# EAGLE design OR gate (EAGLE 6.5.0)
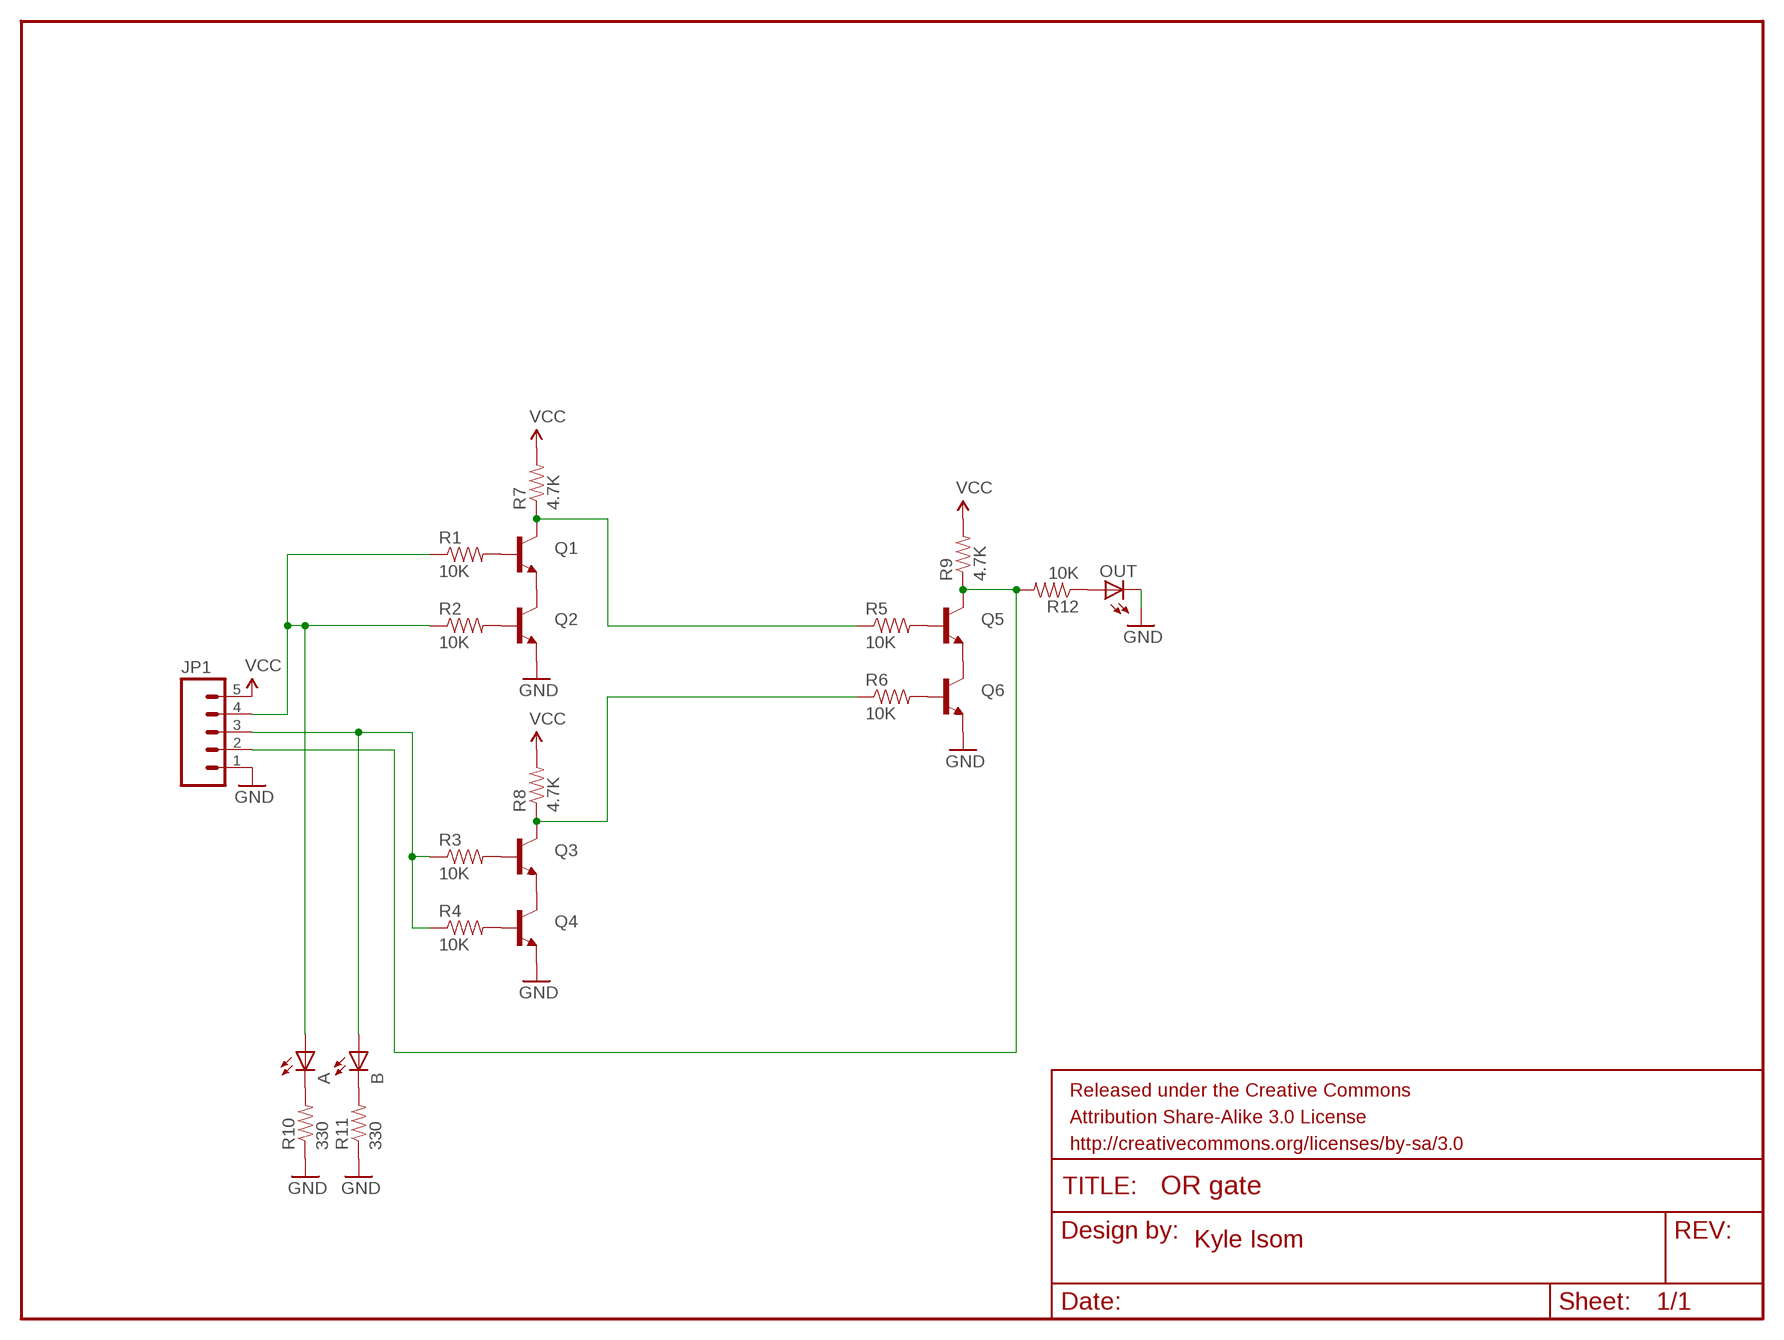
[diagram p0: schematic, sheet 1]

## Parts
A  LED3MM  [LED3MM]
B  LED3MM  [LED3MM]
FRAME1  FRAME-LETTER  [CREATIVE_COMMONS]
JP1  M05LOCK  [1X05_LOCK]
OUT  LED3MM  [LED3MM]
Q1  TRANSISTOR_NPNTO-92-AMMO  [TO-92-AMMO]
Q2  TRANSISTOR_NPNTO-92-AMMO  [TO-92-AMMO]
Q3  TRANSISTOR_NPNTO-92-AMMO  [TO-92-AMMO]
Q4  TRANSISTOR_NPNTO-92-AMMO  [TO-92-AMMO]
Q5  TRANSISTOR_NPNTO-92-AMMO  [TO-92-AMMO]
Q6  TRANSISTOR_NPNTO-92-AMMO  [TO-92-AMMO]
R1  10K  RESISTORPTH-1/4W  [AXIAL-0.4]
R2  10K  RESISTORPTH-1/4W  [AXIAL-0.4]
R3  10K  RESISTORPTH-1/4W  [AXIAL-0.4]
R4  10K  RESISTORPTH-1/4W  [AXIAL-0.4]
R5  10K  RESISTORPTH-1/4W  [AXIAL-0.4]
R6  10K  RESISTORPTH-1/4W  [AXIAL-0.4]
R7  4.7K  RESISTORPTH-1/4W  [AXIAL-0.4]
R8  4.7K  RESISTORPTH-1/4W  [AXIAL-0.4]
R9  4.7K  RESISTORPTH-1/4W  [AXIAL-0.4]
R10  330  RESISTORPTH-1/4W  [AXIAL-0.4]
R11  330  RESISTORPTH-1/4W  [AXIAL-0.4]
R12  10K  RESISTORPTH-1/4W  [AXIAL-0.4]

## Nets
GND: JP1.1 OUT.K(C) Q2.1(E) Q4.1(E) Q6.1(E) R10.P$1 R11.P$1
N$1: OUT.A R12.P$1
N$2: A.K(C) R10.P$2
N$3: B.K(C) R11.P$2
N$4: Q1.2(B) R1.P$2
N$5: Q2.2(B) R2.P$2
N$6: Q3.2(B) R3.P$2
N$7: Q4.2(B) R4.P$2
N$8: Q5.2(B) R5.P$2
N$9: Q6.2(B) R6.P$2
N$10: Q5.1(E) Q6.3(C)
N$11: Q1.1(E) Q2.3(C)
N$12: Q3.1(E) Q4.3(C)
N$13: Q3.3(C) R6.P$1 R8.P$1
N$14: A.A JP1.4 R1.P$1 R2.P$1
N$15: B.A JP1.3 R3.P$1 R4.P$1
N$16: JP1.2 Q5.3(C) R9.P$1 R12.P$2
N$17: Q1.3(C) R5.P$1 R7.P$1
VCC: JP1.5 R7.P$2 R8.P$2 R9.P$2

## Notes on the sheet
- Kyle Isom

## Library data of the parts
A B OUT = SparkFun-LED:LED: LEDs Standard schematic elements and footprints for 5mm, 3mm, 1206, and 0603 sized LEDs. 5mm - Spark Fun Electronics SKU : COM-00529 (and others)
FRAME1 = SparkFun-Aesthetics:FRAME-LETTER: Schematic Frame Standard 8.5x11 US Letter frame
JP1 = SparkFun-Connectors:M05: Header 5 Standard 5-pin 0.1" header. Use with straight break away headers (SKU : PRT-00116), right angle break away headers (PRT-00553), swiss pins (PRT-00743), machine pins (PRT-00117), and female headers (PRT-00115). Molex polarized connector foot print use with SKU : PRT-08230 with associated crimp pins and housings.
Q1-Q6 = SparkFun-DiscreteSemi:TRANSISTOR_NPN: Generic NPN BJT MMBT2222A - TRANS-08049 (SOT-23, 1A 40V) MPSA42 - TRANS-09116 (SOT-23, 500mA 300V) MMBT5088LT1G - TRANS-11160 (SOT-23, 50 mA 30V)
R1-R12 = SparkFun-Passives:RESISTOR: Resistor Basic schematic elements and footprints for 0603, 1206, and PTH resistors.

## Board
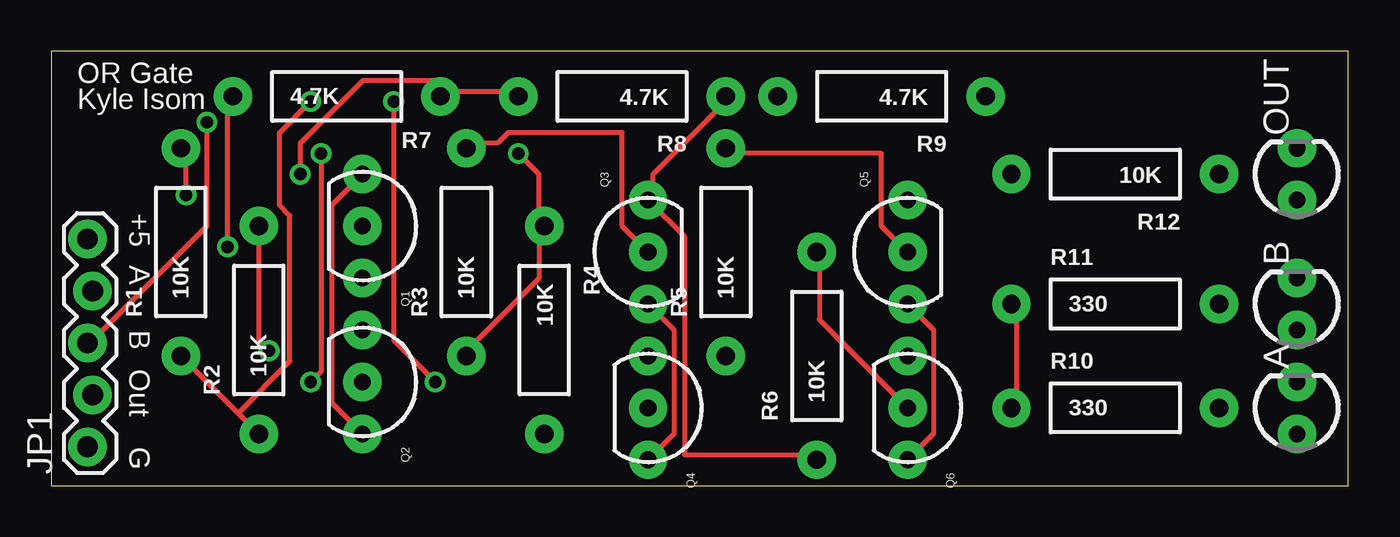
[diagram p1: board, top side]
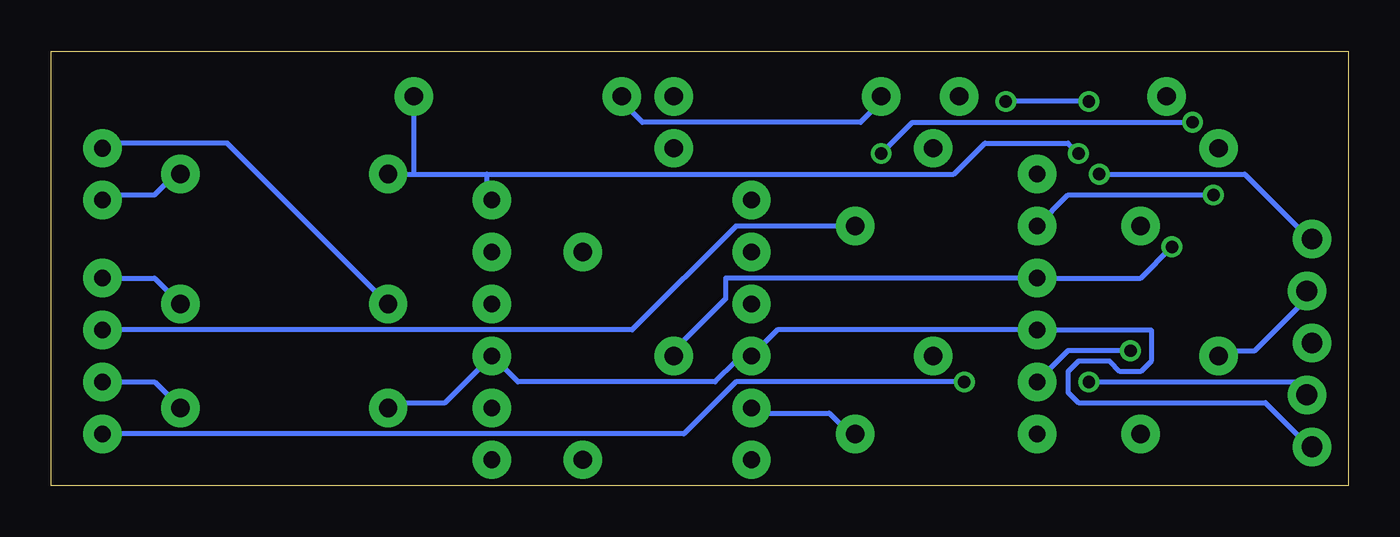
[diagram p2: board, bottom side, seen from below]

Size 63.48 x 21.26 mm. Coordinates in mm from the lower left corner, seen from the top.
Outline: 0,0 63.48,0 63.48,21.26 0,21.26 0,0
Copper layers (1*16): Top 0.035mm / dielectric 1.5mm / Bottom 0.035mm
Design rules "default": minimum track width 10mil, minimum drill 24mil, track to track 8mil, track to pad 8mil, pad to pad 8mil, via to via 8mil, smd to smd 8mil, copper to edge 40mil, drill to drill 8mil, minimum pad ring 10mil, minimum via ring 8mil, stop-mask expansion 4mil, vias tented up to drill 0mil, thermal gap 10mil

### Footprints (pad centres in the part's own frame; a part is rotated, then mirrored left to right if it is on the bottom)
LED3MM = drill 0.813 pad 1.88: A -1.27,0; K 1.27,0
1X05_LOCK = drill 1.016 pad 1.88: 1 0,0.127; 2 2.54,-0.127; 3 5.08,0.127; 4 7.62,-0.127; 5 10.16,0.127
TO-92-AMMO = drill 0.813 pad 1.88: 1 -2.54,0; 2 0,0; 3 2.54,0
AXIAL-0.4 = drill 0.9 pad 1.88: P$1 -5.08,0; P$2 5.08,0

### Placement (x,y rotation side)
A  60.96,3.81 90 top
B  60.96,8.89 90 top
FRAME1  10.16,-8.89 0 top  (outside the outline)
JP1  1.91,1.91 90 top
OUT  60.96,15.24 90 top
Q1  15.24,12.7 270 top
Q2  15.24,5.08 270 top
Q3  29.21,11.43 90 top
Q4  29.21,3.81 270 top
Q5  41.91,11.43 90 top
Q6  41.91,3.81 270 top
R1  6.35,11.43 90 top
R2  10.16,7.62 90 top
R3  20.32,11.43 90 top
R4  24.13,7.62 270 top
R5  33.02,11.43 90 top
R6  37.47,6.35 90 top
R7  13.97,19.05 0 top
R8  27.94,19.05 180 top
R9  40.64,19.05 180 top
R10  52.07,3.81 0 top
R11  52.07,8.89 0 top
R12  52.07,15.24 180 top

### Tracks (layer width: path | path; a pad name or v marks a point on that pad's centre or on a via)
GND
  Top 0.254: R10.P$1 47.24,4.06 47.24,8.64 R11.P$1
  Bottom 0.254: R10.P$1 46.74,4.06 44.2,4.06 Q6.1 40.64,5.08 30.99,5.08 29.97,6.1 29.46,6.1 Q4.1 27.94,7.62 Q2.1 9.65,7.62 9.65,6.1 10.16,5.59 11.18,5.59 11.68,6.1 13.21,6.1 13.72,5.59 13.72,4.57 13.21,4.06 4.06,4.06 2.03,2.03 JP1.1 | R11.P$1 54.86,16.76 60.96,16.76 OUT.K
N$1
  Bottom 0.254: R12.P$1 57.4,15.24 58.42,14.22 60.96,14.22 OUT.A
N$2
  Bottom 0.254: R10.P$2 58.42,5.08 A.K
N$3
  Bottom 0.254: R11.P$2 58.42,10.16 B.K
N$4  (via drill 0.61)
  Top 0.254: v6.6,14.22 6.6,16.26 R1.P$2
  Bottom 0.254: v6.6,14.22 13.72,14.22 Q1.2
N$5  (via drill 0.61)
  Top 0.254: v10.67,6.6 10.16,7.11 R2.P$2
  Bottom 0.254: Q2.2 13.72,6.6 v10.67,6.6
N$6
  Top 0.254: Q3.2 27.94,12.7 27.94,17.27 22.35,17.27 21.84,16.76 20.32,16.76 R3.P$2
N$7
  Bottom 0.254: R4.P$2 24.38,2.54 25.4,3.56 28.96,3.56 Q4.2
N$8
  Top 0.254: Q5.2 40.64,12.7 40.64,16.26 33.02,16.26 R5.P$2
N$9
  Top 0.254: Q6.2 37.59,8.13 37.59,11.18 R6.P$2
N$10
  Top 0.254: Q6.3 43.18,2.54 43.18,7.62 Q5.1
N$11
  Top 0.254: Q2.3 13.72,4.06 13.72,13.72 Q1.1
N$12
  Top 0.254: Q4.3 30.48,2.54 30.48,7.62 Q3.1
N$13
  Top 0.254: R6.P$1 37.08,1.52 30.99,1.52 30.99,12.19 Q3.3 29.46,14.22 29.46,15.24 33.02,18.8 R8.P$1
N$14  (via drill 0.61)
  Top 0.254: R1.P$1 9.14,3.56 | 9.14,3.56 R2.P$1 | v18.8,5.08 16.76,7.11 v16.76,18.8 | v12.7,18.8 11.18,17.27 11.18,13.72 11.68,13.21 11.68,6.1 9.14,3.56
  Bottom 0.254: JP1.4 2.03,9.14 4.57,6.6 6.1,6.6 R1.P$1 | A.A 32.51,2.54 29.97,5.08 v18.8,5.08 | v12.7,18.8 v16.76,18.8
N$15  (via drill 0.61)
  Top 0.254: v7.62,17.78 7.62,12.7 2.03,7.11 JP1.3 | v22.86,16.26 23.88,15.24 23.88,12.7 | 23.88,12.7 23.88,10.16 20.32,6.6 R3.P$1 | 23.88,12.7 R4.P$1
  Bottom 0.254: v7.62,17.78 21.34,17.78 v22.86,16.26 | B.A 35.05,7.62 29.97,12.7 R4.P$1
N$16  (via drill 0.61)
  Top 0.254: v12.7,5.08 13.21,5.59 v13.21,16.26
  Bottom 0.254: v12.7,5.08 2.54,5.08 2.03,4.57 JP1.2 | v13.21,16.26 13.72,16.76 17.78,16.76 19.3,15.24 42.16,15.24 | R12.P$2 45.72,15.24 | 45.72,15.24 42.16,15.24 | 42.16,15.24 42.16,14.22 Q5.3 | 45.72,15.24 R9.P$1
N$17  (via drill 0.61)
  Top 0.254: v8.64,11.68 8.64,18.8 R7.P$1
  Bottom 0.254: v8.64,11.68 10.16,10.16 Q1.3 30.48,10.16 30.48,9.14 33.02,6.6 R5.P$1
VCC  (via drill 0.61)
  Top 0.254: v12.19,15.24 12.19,16.76 15.24,19.81 18.8,19.81 18.8,19.3 R7.P$2 19.3,19.3 22.86,19.3 R8.P$2
  Bottom 0.254: v12.19,15.24 5.08,15.24 2.03,12.19 JP1.5 | R9.P$2 35.56,18.8 34.54,17.78 23.88,17.78 22.86,18.8 R8.P$2

### Text on the board
tPlace: OR Gate | Kyle Isom | +5 | A | B | Out | G